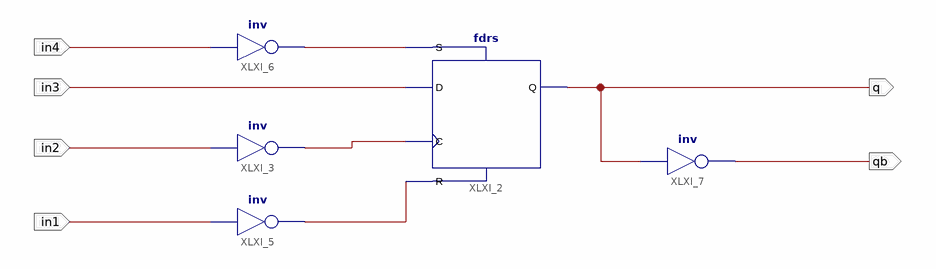
[diagram p0: schematic sheet 1]
// Xilinx ISE schematic mioc_flop_xilinx.sch (xc9500xl) as structural Verilog: 5 symbols, 6 ports
module mioc_flop_xilinx (
  input  in2,
  input  in1,
  input  in3,
  input  in4,
  output q,
  output qb
);

  wire in1_b, in2_n, in4_b;

  fdrs XLXI_2 (.C(in2_n), .D(in3), .R(in1_b), .S(in4_b), .Q(q));
  not XLXI_3 (in2_n, in2);
  not XLXI_5 (in1_b, in1);
  not XLXI_6 (in4_b, in4);
  not XLXI_7 (qb, q);
endmodule
